# EAGLE design BPF_LNA_1550A (EAGLE 9.6.2)
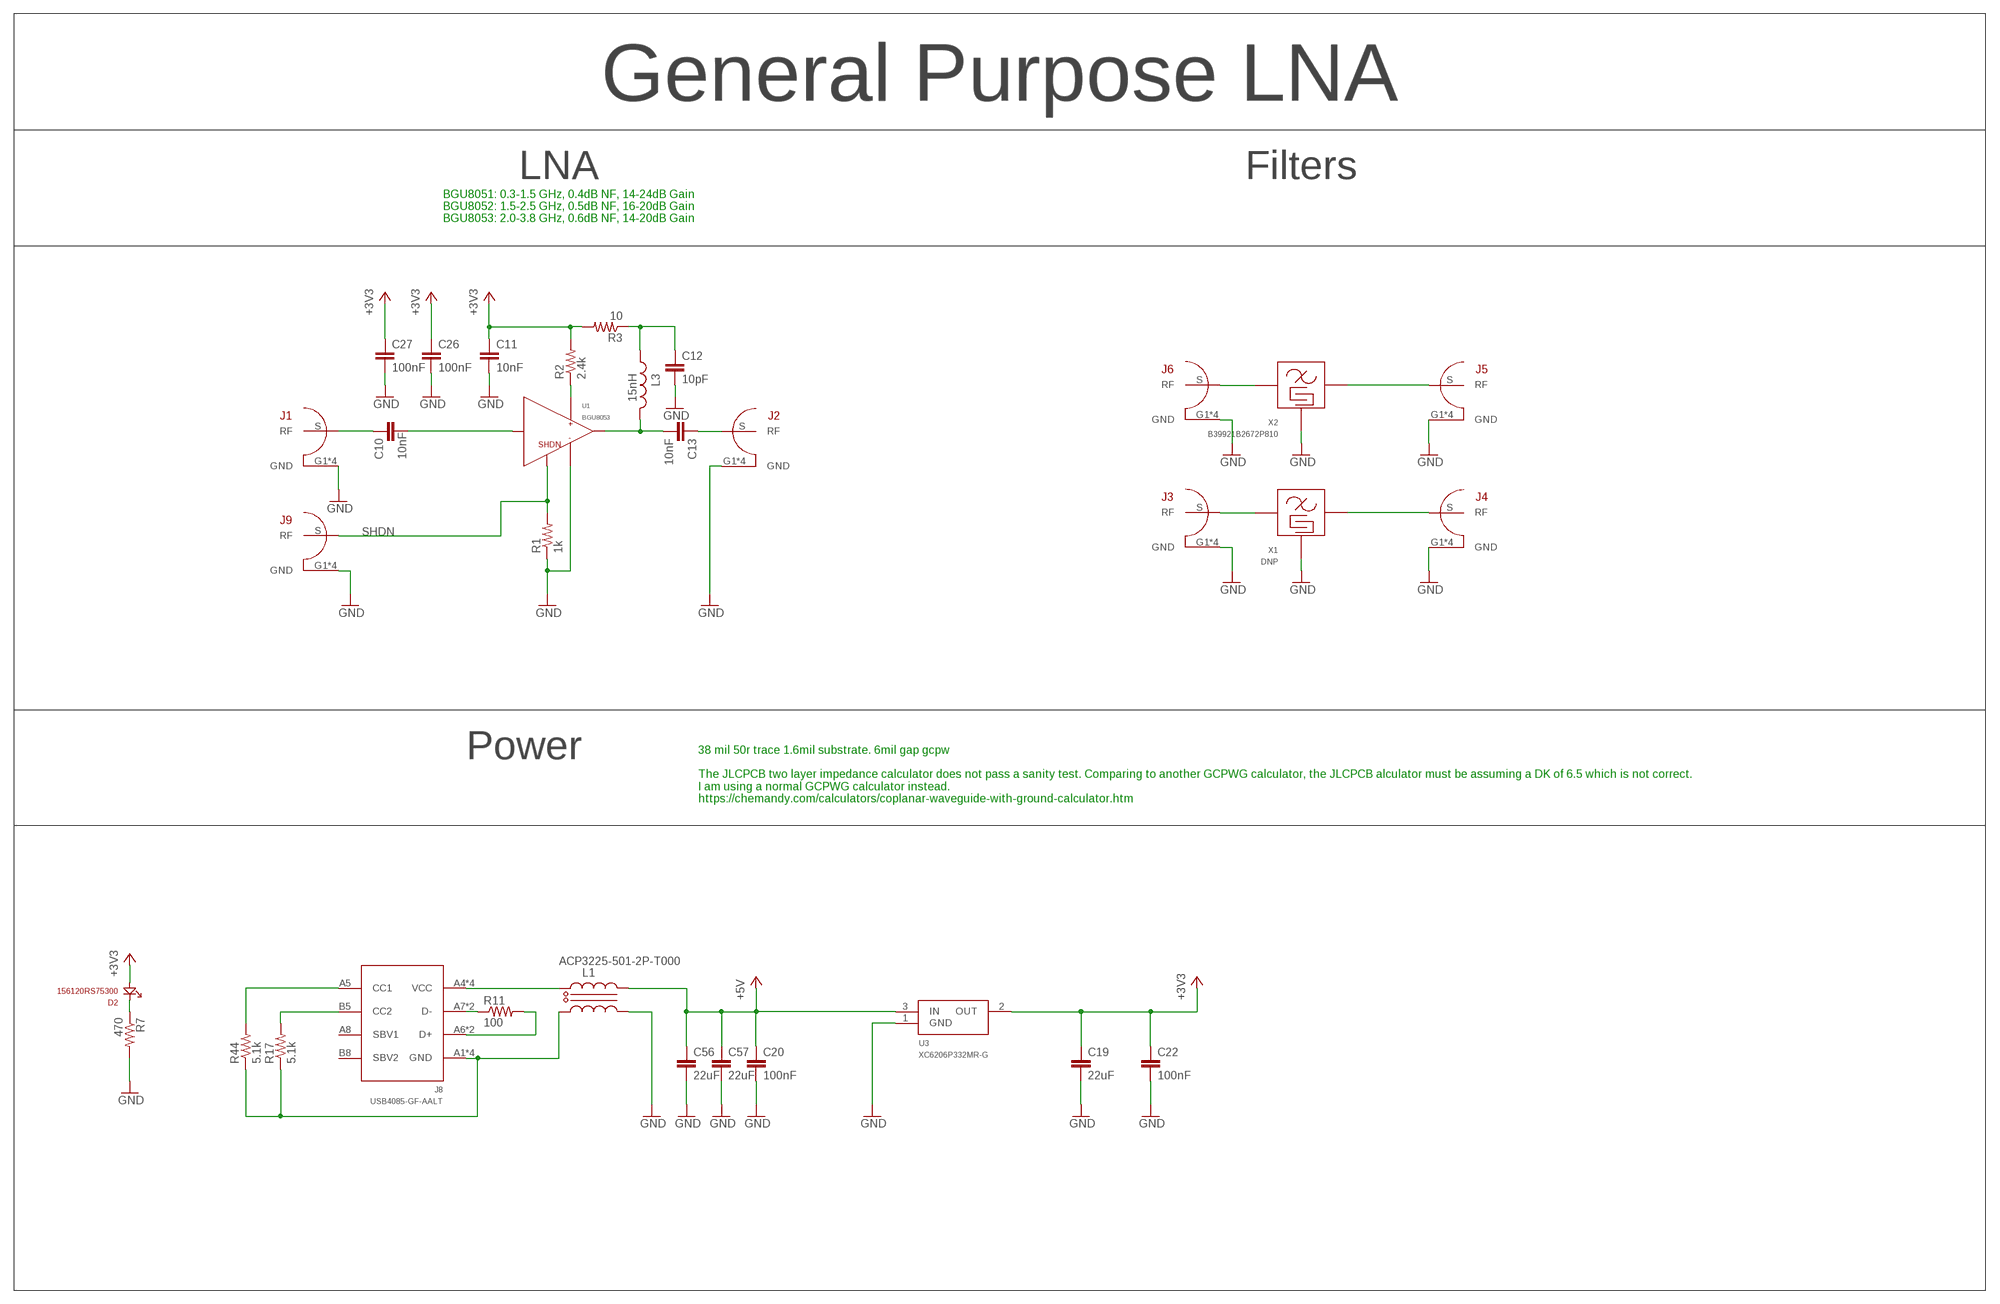
[diagram p0: schematic, sheet 1]

## Parts
C10  10nF  0603_CAPACITOR  [0603]
C11  10nF  0603_CAPACITOR  [0603]
C12  10pF  0603_CAPACITOR  [0603]
C13  10nF  0603_CAPACITOR  [0603]
C19  22uF  C-EUC1206  [C1206]
C20  100nF  0603_CAPACITOR  [0603]
C22  100nF  0603_CAPACITOR  [0603]
C26  100nF  0603_CAPACITOR  [0603]
C27  100nF  0603_CAPACITOR  [0603]
C56  22uF  C-EUC1206  [C1206]
C57  22uF  C-EUC1206  [C1206]
D2  156120RS75300  [1206_REV]
J1  0733910070  [CONREVSMA008-G]
J2  0733910070  [CONREVSMA008-G]
J3  0733910070  [CONREVSMA008-G]
J4  0733910070  [CONREVSMA008-G]
J5  0733910070  [CONREVSMA008-G]
J6  0733910070  [CONREVSMA008-G]
J8  USB4085-GF-AALT  [USBC2]
J9  0733910070  [CONREVSMA008-G]
L1  ACP3225-501-2P-T000  [3225]
L3  15nH  0603_INDUCTOR  [0603]
R1  1k  0603_RESISTOR  [0603]
R2  2.4k  0603_RESISTOR  [0603]
R3  10  0603_RESISTOR  [0603]
R7  470  0603_RESISTOR  [0603]
R11  100  0603_RESISTOR  [0603]
R17  5.1k  0603_RESISTOR  [0603]
R44  5.1k  0603_RESISTOR  [0603]
U1  BGU8053  BGU8051  [SOT1327-1]
U3  XC6206P332MR-G  [SOT23-3_CENTERED]
X1  DNP  TA0862A  [TA0862A]
X2  B39921B2672P810  [B2672]

## Nets
+3V3: C11.1 C19.1 C22.1 C26.1 C27.1 D2.A R2.2 R3.2 U3.2(OUT)
+5V: C20.1 C56.1 C57.1 L1.4(1OUT) U3.3(IN)
AMP_OUT: C13.2 L3.2 U1.7(OUT)
AMPIN: C10.2 U1.2(IN)
GND: C11.2 C12.2 C19.2 C20.2 C22.2 C26.2 C27.2 C56.2 C57.2 J1.G1(GND) J1.G2(GND) J1.G3(GND) J1.G4(GND) J2.G1(GND) J2.G2(GND) J2.G3(GND) J2.G4(GND) J3.G1(GND) J3.G2(GND) J3.G3(GND) J3.G4(GND) J4.G1(GND) J4.G2(GND) J4.G3(GND) J4.G4(GND) J5.G1(GND) J5.G2(GND) J5.G3(GND) J5.G4(GND) J6.G1(GND) J6.G2(GND) J6.G3(GND) J6.G4(GND) J9.G1(GND) J9.G2(GND) J9.G3(GND) J9.G4(GND) L1.3(2OUT) R1.1 R7.2 U1.EP(GND) U3.1(GND) X1.A(GND) X1.C(GND) X1.D(GND) X1.F(GND) X2.2(GND) X2.3(GND) X2.5(GND)
N$1: D2.K R7.1
N$3: J3.S(RF) X1.B
N$6: J5.S(RF) X2.4
N$8: C10.1 J1.S(RF)
N$9: J8.A1(GND) J8.A12(GND) J8.B1(GND) J8.B12(GND) L1.2(2IN) R17.1 R44.1
N$10: J6.S(RF) X2.1
N$11: R2.1 U1.1(VCC)
N$12: J8.A4(VCC) J8.A9(VCC) J8.B4(VCC) J8.B9(VCC) L1.1(1IN)
N$13: C12.1 L3.1 R3.1
N$14: C13.1 J2.S(RF)
N$21: J4.S(RF) X1.E
N$24: J8.A7(D-) J8.B7(D-) R11.1
N$25: J8.A6(D+) J8.B6(D+) R11.2
N$27: J8.B5(CC2) R17.2
N$32: J8.A5(CC1) R44.2
SHDN: J9.S(RF) R1.2 U1.6(SHDN)
Unconnected: J8.A8(SBV1) J8.B8(SBV2)

## Notes on the sheet
- General Purpose LNA
- LNA | Filters
- BGU8051: 0.3-1.5 GHz, 0.4dB NF, 14-24dB Gain
  BGU8052: 1.5-2.5 GHz, 0.5dB NF, 16-20dB Gain
  BGU8053: 2.0-3.8 GHz, 0.6dB NF, 14-20dB Gain
- Power
- 38 mil 50r trace 1.6mil substrate. 6mil gap gcpw
  
  The JLCPCB two layer impedance calculator does not pass a sanity test. Comparing to another GCPWG calculator, the JLCPCB alculator must be assuming a DK of 6.5 which is not correct. 
  I am using a normal GCPWG calculator instead.
  https://chemandy.com/calculators/coplanar-waveguide-with-ground-calculator.htm

## Library data of the parts
C10-C13 C20 C22 C26 C27 = ruark2:0603_CAPACITOR: 0603 Capacitor -- WARNING: NO DEFINED VALUE OR PART NUMBER; VALUE: sel
C19 C56 C57 = rcl:C-EU: CAPACITOR, European symbol; SPICEPREFIX: C
D2 = ruark2:156120RS75300: Red 624nm LED Indication - Discrete 2V 1206 Reverse Mount (3216 Metric); PARTNO: 732-5031-1-ND
J1-J6 J9 = ruark2:0733910070: SMA Connector Receptacle, Female Socket 50Ohm Through Hole Solder; PARTNO: WM5544-ND
J8 = ruark2:USB4085-GF-A: USB - C USB 2.0 Receptacle Connector 16 Position Through Hole, Right Angle
L1 = ruark2:ACP3225-501-2P-T000: 2 Line Common Mode Choke Surface Mount 500 Ohms @ 100 MHz 2A DCR 40mOhm (Typ); PARTNO: 445-172408-1-ND
L3 = ruark2:0603_INDUCTOR: 0603 Inductor: WARNING: NO DEFINED PART NUMBER OR VALUE; VALUE: sel
R1-R3 R7 R11 R17 R44 = ruark2:0603_RESISTOR: 0603 Resistor -- WARNING: NO DEFINED PART NUMBER OR VALUE; VALUE: sel
U1 = ruark2:BGU8051: RF Amplifier IC GSM, LTE, W-CDMA 300MHz ~ 1.5GHz 8-HWSON (2x2); PARTNO: 568-BGU8051XCT-ND
U3 = ruark2:XC6206P332MR-G: 200mA Fixed 3.3V Positive electrode 6V SOT-23-3L Voltage Regulators - Linear, Low Drop Out (LDO) Regulators ROHS; JLC: C5446
X1 = ruark2:TA0862A: 1.26852GHz Frequency Wireless RF SAW Filter (Surface Acoustic Wave) 3.2dB 20.46MHz Bandwidth 6-SMD, No Lead; PARTNO: 4606-TA0862ACT-ND
X2 = ruark2:B39921B2672P810: 915MHz Frequency General Purpose RF SAW Filter (Surface Acoustic Wave) 1.1dB 26MHz Bandwidth 5-SMD, No Lead; PARTNO: 1752-B39921B2672P810CT-ND

## Board
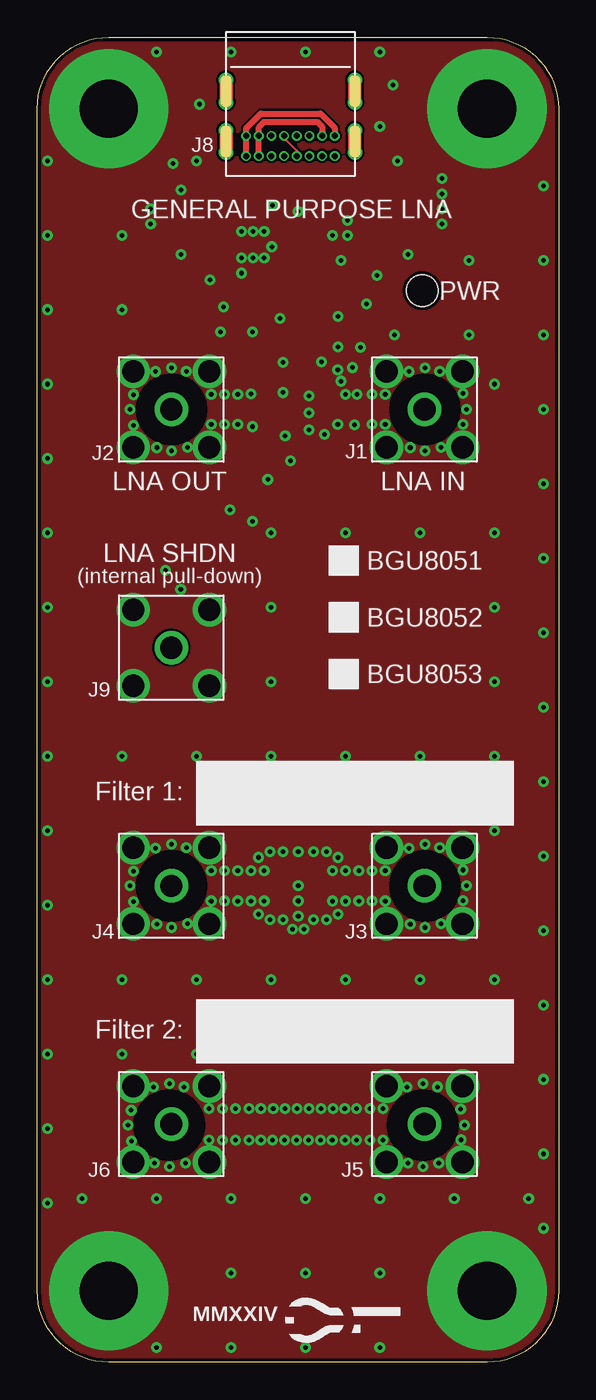
[diagram p1: board, top side]
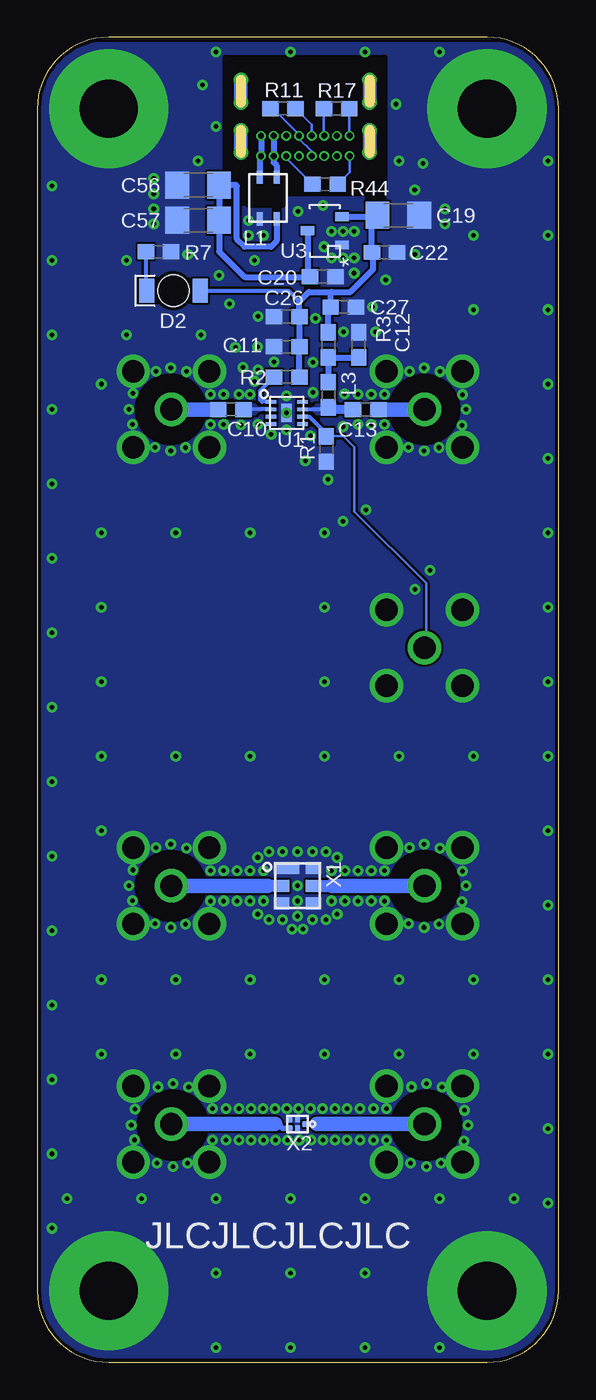
[diagram p2: board, bottom side, seen from below]

Size 35 x 89 mm. Coordinates in mm from the lower left corner, seen from the top.
Outline: 30.2,0 4.8,0 arc-90 0,4.8 0,84.2 arc-90 4.8,89 30.2,89 arc-90 35,84.2 35,4.8 arc-90 30.2,0
Copper layers (1*16): Top 0.035mm / dielectric 1.5mm / Bottom 0.035mm
Design rules "default *": minimum track width 5mil, minimum drill 12mil, track to track 6mil, track to pad 6mil, pad to pad 6mil, via to via 6mil, smd to smd 6mil, copper to edge 10mil, drill to drill 6mil, minimum pad ring 5mil, minimum via ring 8mil, stop-mask expansion 4mil, vias tented up to drill 12mil, thermal gap 10mil
tRestrict: area 23.7,29.7 to 28.3,34.3; area 6.7,29.7 to 11.3,34.3; area 23.7,29.7 to 28.3,34.3; area 23.7,61.7 to 28.3,66.3; area 6.7,61.7 to 11.3,66.3; area 23.7,61.7 to 28.3,66.3; area 23.6,13.6 to 28.2,18.2; area 6.6,13.6 to 11.2,18.2; area 23.6,13.6 to 28.2,18.2
bRestrict: area 14.8,64.7 to 16.1,65.2; area 23.7,29.7 to 28.3,34.3; area 6.7,29.7 to 11.3,34.3; area 23.7,29.7 to 28.3,34.3; area 23.7,61.7 to 28.3,66.3; area 6.7,61.7 to 11.3,66.3; area 23.7,61.7 to 28.3,66.3; area 23.6,13.6 to 28.2,18.2; area 6.6,13.6 to 11.2,18.2; area 23.6,13.6 to 28.2,18.2; area 12.7,63.5 to 13.2,64.5; 4 lines

### Footprints (pad centres in the part's own frame; a part is rotated, then mirrored left to right if it is on the bottom)
0603 = smd 1.1 x 1: 1 -0.85,0; 2 0.85,0
C1206 = smd 1.6 x 1.8: 1 -1.4,0; 2 1.4,0
1206_REV = smd 1 x 1.6: A -1.8,0; K 1.8,0 | hole 2.1: 0,0
CONREVSMA008-G = drill 1.499: G1 -2.553,2.553; G2 2.553,2.553; G3 2.553,-2.553; G4 -2.553,-2.553; S 0,0
USBC2 = drill 0.4 pad 0.65: A1 -2.975,0.98; A4 -2.125,0.98; A5 -1.275,0.98; A6 -0.425,0.98; A7 0.425,0.98; A8 1.275,0.98; A9 2.125,0.98; A12 2.975,0.98; B1 2.975,-0.37; B4 2.125,-0.37; B5 1.275,-0.37; B6 0.425,-0.37; B7 -0.425,-0.37; B8 -1.275,-0.37; B9 -2.125,-0.37; B12 -2.975,-0.37 | drill 0.65 pad 0.9: P$1 -4.325,0.75; P$2 4.325,0.75; P$3 4.325,-0.75; P$4 -4.325,-2.63; P$5 -4.325,-0.75; P$6 -4.325,-4.13; P$7 4.325,-2.63; P$8 4.325,-4.13
3225 = smd 0.9 x 0.4: 1 -1.4,0.575; 2 -1.4,-0.575; 3 1.4,-0.575; 4 1.4,0.575
SOT1327-1 = smd 0.7 x 0.25: 1 -1.05,0.75; 2 -1.05,0.25; 3 -1.05,-0.25; 4 -1.05,-0.75; 5 1.05,-0.75; 6 1.05,-0.25; 7 1.05,0.25; 8 1.05,0.75 | smd 0.7 x 1.25: EP 0,0
SOT23-3_CENTERED = smd 0.6 x 0.9: 1 -0.95,-1.15; 2 0.95,-1.15; 3 0,1.15
TA0862A = smd 0.81 x 1.7: A -1.191,-0.745 | smd 0.81 x 1.05: B 0,-1.07; C 1.19,-1.07; D 1.19,1.07; E 0,1.07; F -1.19,1.07
B2672 = smd 0.3 x 0.375: 1 -0.5,0; 2 0,-0.287; 3 0.5,-0.287; 4 0.5,0.287; 5 0,0.287

### Placement (x,y rotation side)
C10  22,64 0 bottom
C11  18.25,68.21 180 bottom
C12  13.42,68.33 90 bottom
C13  12.94,64 180 bottom
C19  10.76,77.04 0 bottom
C20  15.83,72.92 0 bottom
C22  11.68,74.55 0 bottom
C26  18.25,70.24 180 bottom
C27  14.44,70.88 0 bottom
C56  24.19,79.07 180 bottom
C57  24.19,76.71 180 bottom
D2  25.86,71.97 180 bottom
J1  26,64 0 top
J2  9,64 0 top
J3  26,32 0 top
J4  9,32 0 top
J5  26,16 0 top
J6  9,16 0 top
J8  17,82 180 top
J9  9,48 0 top
L1  19.5,78.2 270 bottom
L3  15.46,64.98 270 bottom
R1  15.58,61.35 90 bottom
R2  18.25,66.18 0 bottom
R3  15.46,68.33 90 bottom
R7  26.86,74.58 0 bottom
R11  18.5,84.2 0 bottom
R17  14.9,84.2 180 bottom
R44  15.67,79.12 180 bottom
U1  18.25,63.76 0 bottom
U3  15.7,76 90 bottom
X1  17.53,32 270 bottom
X2  17.53,16 180 bottom

### Tracks (layer width: path | path; a pad name or v marks a point on that pad's centre or on a via)
+3V3
  Bottom 0.254: 15.33,71 15.33,70.91 C27.1 | D2.A 21.59,71.97 21.5,71.97 18.13,71.97 17.4,71.25
  Bottom 0.406: R2.2 C11.1 C26.1 17.4,71.25 16.76,71.88 15.24,71.88 | R3.2 15.46,70.88 15.33,71 | U3.2 12.7,76.95 | 12.7,76.95 12.25,76.95 C19.1 | 12.7,76.95 12.53,76.78 C22.1 12.45,74.46 12.45,73.41 13.97,71.88 15.24,71.88 | C27.1 15.29,71.83 15.24,71.88
+5V
  Bottom 0.406: L1.4 18.93,75.31 19.3,74.93 21.08,74.93 21.59,75.44 21.59,78.99 21.66,79.07 C56.1 C57.1 22.79,74.61 21.08,72.9 16.7,72.9 C20.1 16.85,73.08 U3.3
AMP_OUT
  Bottom 0.254: U1.7 15.58,64.01 15.57,64.01 L3.2
  Bottom 0.6: 15.58,64.01 13.8,64.01 C13.2
  pour Bottom (no thermals): 14.97,63.66 16.24,63.66 16.6,64.02 16.24,64.37 14.97,64.37
AMPIN
  Bottom 0.254: 21.25,64.04 21.26,64.05 20.02,64.02 20.03,64.02 U1.2
  pour Bottom (no thermals): 21.55,64.37 20.39,64.37 20.03,64.02 20.39,63.66 21.55,63.66
GND  (via drill 0.3, 3.9 pad 8)
  other vias: 14.36,65.03 16.65,62.24 18.25,64.91 18.25,62.62 18.25,63.76 20.18,66.66 21.7,68.18 21.31,62.97 16.5,65.13 16.5,67.16 14.44,69.2 19.1,67.2 20.4,65.9 20.18,63 19.29,62.34 21.17,66.81 20.2,68.2 20.18,70.24 16.31,70.12 9.02,34.8 10.01,34.57 7.95,34.54 11.68,33.02 12.57,33.02 11.68,30.99 12.57,30.99 6.22,32 6.45,32.99 6.48,30.94 9.02,29.21 8.03,29.44 10.08,29.46 14.35,33.02 13.46,33.02 13.46,30.99 14.35,30.99 15.24,30.99 16.51,29.72 15.62,29.72 15.62,34.29 16.51,34.29 15.24,33.02 26.04,29.21 25.04,29.44 27.1,29.46 23.37,30.99 22.48,30.99 23.37,33.02 22.48,33.02 28.83,32 28.6,31.01 28.57,33.07 26.04,34.8 27.03,34.57 24.97,34.54 20.7,30.99 21.59,30.99 21.59,33.02 20.7,33.02 19.81,33.02 18.54,34.29 19.43,34.29 19.43,29.72 18.54,29.72 19.81,30.99 20.19,33.91 14.86,33.91 17.91,29.08 17.14,29.08 4.8,4.8 30.2,4.8 30.2,84.2 4.8,84.2 9.02,66.8 10.01,66.57 7.95,66.54 11.68,65.02 12.57,65.02 11.68,62.99 12.57,62.99 6.22,64 6.45,64.99 6.48,62.94 9.02,61.21 8.03,61.44 10.08,61.46 13.46,65.02 13.46,62.99 26.04,61.21 25.04,61.44 27.1,61.46 23.37,62.99 22.48,62.99 23.37,65.02 22.48,65.02 28.83,64 28.6,63.01 28.57,65.07 26.04,66.8 27.03,66.57 24.97,66.54 9.65,78.74 9.11,80.51 24.89,74.42 8.88,18.73 9.87,18.5 7.81,18.47 11.54,17.05 12.43,17.05 11.54,14.92 12.43,14.92 6.08,15.93 6.31,16.92 6.33,14.87 8.88,13.14 7.88,13.37 9.94,13.39 14.21,17.05 13.32,17.05 13.32,14.92 14.21,14.92 25.89,13.14 24.9,13.37 26.96,13.39 23.23,14.92 22.34,14.92 23.23,17.05 22.34,17.05 28.69,15.93 28.46,14.94 28.43,17 25.89,18.73 26.88,18.5 24.83,18.47 20.66,14.92 21.45,14.92 21.45,17.05 0.7,80.7 0.7,75.7 0.7,70.7 0.7,65.7 0.7,60.7 0.7,55.7 0.7,50.7 0.7,45.7 0.7,40.7 0.7,35.7 0.7,30.7 0.7,25.7 0.7,20.7 0.7,15.7 0.7,10.7 30.7,20.7 30.7,35.7 30.7,65.7 30.7,50.7 10.7,80.7 8,1 34,9 13,1 18,1 23,1 34,14 34,19 34,24 34,29 34,34 34,39 34,44 34,49 34,54 34,59 34,64 34,69 34,79 34,74 8,88 13,88 18,88 23,88 25.7,20.7 20.7,20.7 15.7,20.7 10.7,20.7 5.7,20.7 5.7,25.7 10.7,25.7 15.7,25.7 20.7,25.7 25.7,25.7 30.7,25.7 13,6 18,6 23,6 23,11 18,11 8,11 13,11 28,11 3,11 33,11 5.7,40.7 10.7,40.7 15.7,40.7 20.7,40.7 25.7,40.7 30.7,40.7 30.7,45.7 15.7,45.7 15.7,50.7 15.7,55.7 30.7,55.7 25.7,55.7 20.7,55.7 5.7,70.7 12.5,70.9 29,69 24,69 5.7,75.7 29,74 23,83 21.46,65.02 20.7,65.02 17,60.56 15.48,59.29 14.46,62.85 12.3,69.2 12.94,57.26 9.64,51.92 8.62,53.19 14.46,56.5 20.65,17.05 19.81,75.69 20.83,75.69 15.24,74.17 13.72,74.17 14.48,74.17 13.72,75.95 14.48,75.95 15.24,75.95 15.75,74.93 13.72,73.15 7.62,77.47 7.62,76.45 9.65,74.42 27.18,79.5 27.18,78.49 27.18,77.47 27.18,76.45 20.83,76.71 24.2,80.7 22.8,73 20.4,74 17.5,77.3 15.8,77.7 11.6,72.7 22.1,71.1 23.9,85.8 10.9,84.5 17.53,32 17.53,30.99 17.53,29.97 17.53,34.29 20.19,30.1 14.86,30.1 19.85,17.05 19.05,17.05 18.25,17.05 17.45,17.05 16.65,17.05 15.85,17.05 15.01,17.05 15.01,14.92 15.81,14.92 16.61,14.92 17.41,14.92 18.21,14.92 19.01,14.92 19.81,14.92
  pour Top (rank 5, no thermals): 35,0 35,88.56 0.06,88.56 0.06,0
  pour Bottom (rank 3, no thermals): 35,0 35,88.56 0.06,88.56 0.06,0
N$1
  Bottom 0.254: R7.1 27.71,72.03 D2.K
N$2
  Bottom 0.965: 9,64
N$3
  Bottom 0.813: X1.B 19.53,32 19.54,32
  Bottom 0.965: 19.54,32 J3.S
N$5
  Bottom 0.965: 26.05,32
N$6
  Bottom 0.381: X2.4 18.51,15.71 18.79,16 19.03,16
  Bottom 0.965: 19.03,16 J5.S
N$7
  Bottom 0.965: 26.05,64
N$8
  Bottom 0.965: J1.S C10.1
N$9
  Top 0.406: J8.A12 J8.B1 14.03,82.89 15.01,83.87 19.03,83.87 19.98,82.92 J8.B12
  Bottom 0.152: R44.1 14.03,79.92 J8.A12 | R17.1 14.05,82.39 J8.B1
  Bottom 0.406: J8.B12 J8.A1 20.07,80.92 L1.2
N$10
  Bottom 0.381: X2.1 16.22,16
  Bottom 0.965: 16.22,16 J6.S
N$11
  Bottom 0.254: U1.1 19.31,64.53 19.9,64.53 20.03,64.65 20.03,65.25 R2.1
N$12
  Top 0.406: J8.A9 J8.B4 14.88,82.95 15.24,83.31 18.8,83.31 19.12,82.98 J8.B9
  Bottom 0.406: J8.B9 J8.A4 19.12,80.59 18.93,80.39 L1.1
N$13
  Bottom 0.406: L3.1 R3.1 C12.1
N$14
  Bottom 0.965: J2.S C13.1
N$21
  Bottom 0.508: 15.24,32
  Bottom 0.813: X1.E 15.24,32
  Bottom 0.965: J4.S 15.24,32
N$24
  Bottom 0.152: R11.1 19.15,84.2 17.43,82.47 J8.B7 17.43,82.19 16.57,81.34 J8.A7
N$25
  Top 0.152: J8.B6 16.57,82.23 17.43,81.38 J8.A6
  Bottom 0.152: R11.2 16.57,83.12 J8.B6
N$27
  Bottom 0.152: J8.B5 15.72,82.39 15.75,82.41 R17.2
N$32
  Bottom 0.152: J8.A5 18.27,80.87 R44.2
NAN
  cutout Bottom: 22.35,87.63 11.68,87.63 11.68,78.49 18.54,78.49 18.54,77.72 20.83,77.72 22.35,79.25
SHDN
  Bottom 0.152: R1.2 14.45,62.2 13.72,61.47 13.72,57.15 8.89,52.32 8.89,48.11 J9.S
  Bottom 0.254: U1.6 16.73,63.51 15.58,62.37 R1.2

### Text on the board
tPlace: GENERAL PURPOSE LNA | PWR | LNA OUT | LNA IN | LNA SHDN | (internal pull-down) | BGU8051 / / BGU8052 / / BGU8053 | Filter 1: | Filter 2: | MMXXIV
bPlace: JLCJLCJLCJLC
tStop: 033